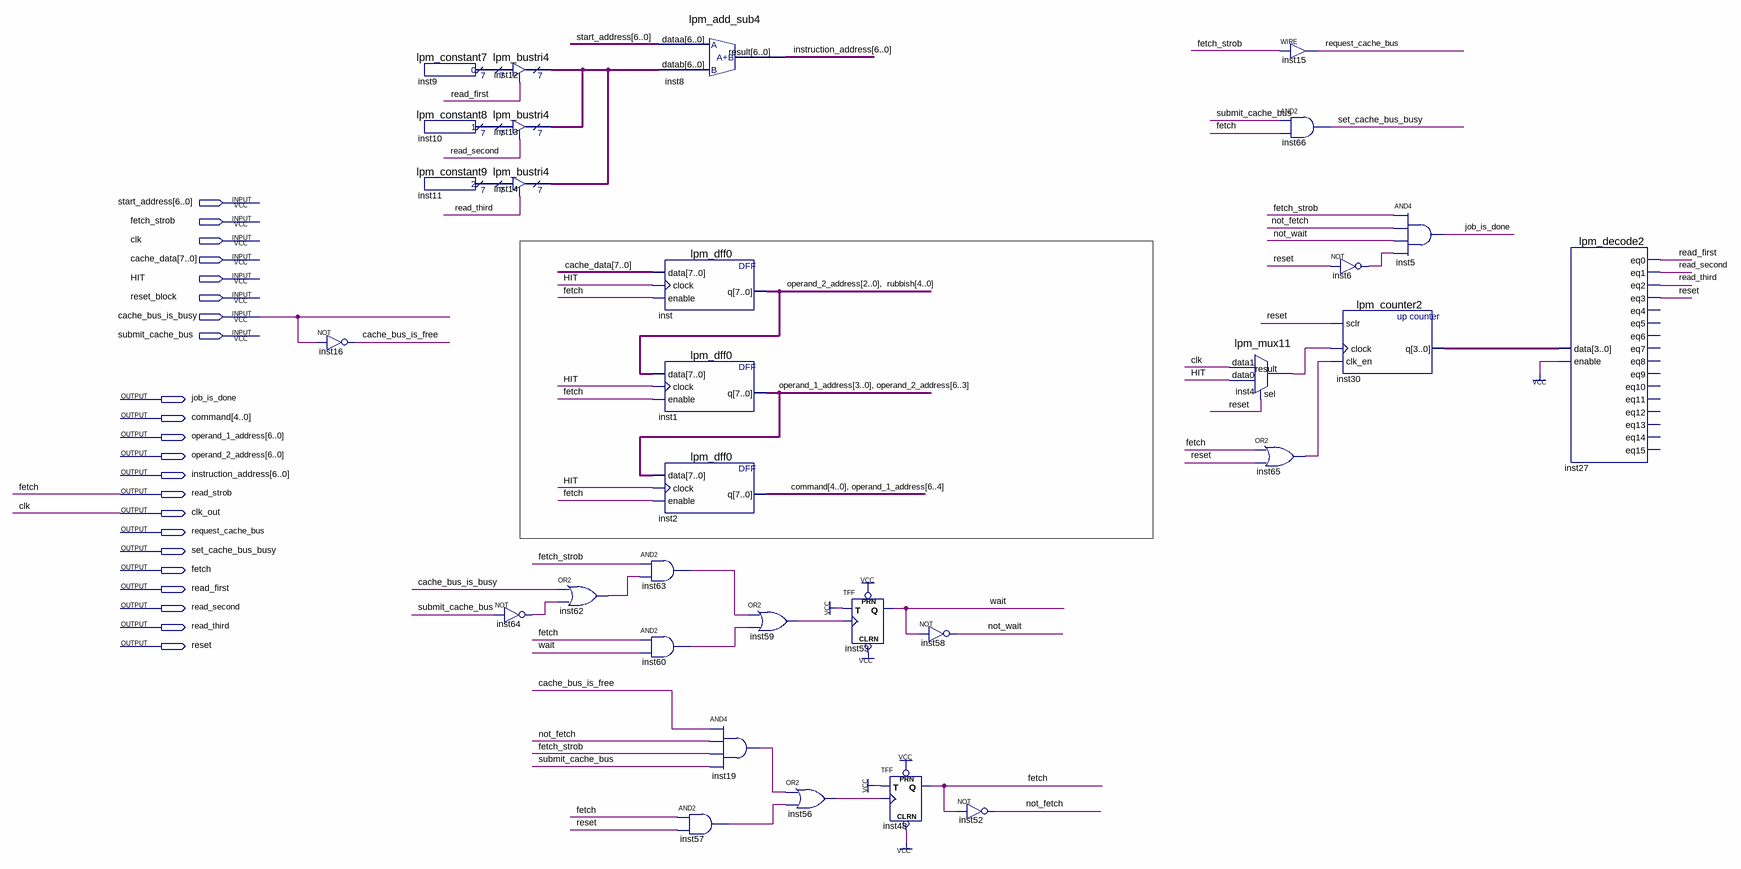
[diagram p0: schematic sheet]
// Quartus schematic InstructionFetchAndDecodeBlock.bdf as structural Verilog: 31 symbols, 22 pins
module InstructionFetchAndDecodeBlock (
  input  [6:0] start_address,
  input  fetch_strob,
  input  clk,
  input  [7:0] cache_data,
  input  HIT,
  input  reset_block,
  input  cache_bus_is_busy,
  input  submit_cache_bus,
  output job_is_done,
  output [4:0] command,
  output [6:0] operand_1_address,
  output [6:0] operand_2_address,
  output [6:0] instruction_address,
  output read_strob,
  output clk_out,
  output request_cache_bus,
  output set_cache_bus_busy,
  output fetch,
  output read_first,
  output read_second,
  output read_third,
  output reset
);

  wire cache_bus_is_free, inst4_result, inst6_out, inst19_out, inst56_out, inst57_out, inst59_out,
       inst60_out, inst62_out, inst63_out, inst64_out, inst65_out, not_fetch, not_wait, \wait ;
  wire [3:0] inst30_q;
  wire [4:0] rubbish;
  wire [6:0] inst9_result, inst10_result, inst11_result, inst12_tridata;

  not inst16 (cache_bus_is_free, cache_bus_is_busy);
  lpm_constant7 inst9 (.result(inst9_result));
  lpm_constant8 inst10 (.result(inst10_result));
  lpm_constant9 inst11 (.result(inst11_result));
  lpm_bustri4 inst12 (.enabledt(read_first), .data(inst9_result), .tridata(inst12_tridata));
  lpm_bustri4 inst13 (.enabledt(read_second), .data(inst10_result), .tridata(inst12_tridata));
  lpm_bustri4 inst14 (.enabledt(read_third), .data(inst11_result), .tridata(inst12_tridata));
  not inst64 (inst64_out, submit_cache_bus);
  or inst62 (inst62_out, cache_bus_is_busy, inst64_out);
  and inst63 (inst63_out, fetch_strob, inst62_out);
  and inst60 (inst60_out, fetch, \wait );
  lpm_add_sub4 inst8 (.dataa(start_address), .datab(inst12_tridata), .result(instruction_address));
  lpm_dff0 inst (.data(cache_data), .clock(HIT), .enable(fetch), .q({operand_2_address[2:0], rubbish}));
  lpm_dff0 inst1 (
    .data({operand_2_address[2:0], rubbish}), .clock(HIT), .enable(fetch),
    .q({operand_1_address[3:0], operand_2_address[6:3]}));
  lpm_dff0 inst2 (
    .data({operand_1_address[3:0], operand_2_address[6:3]}), .clock(HIT), .enable(fetch),
    .q({command, operand_1_address[6:4]}));
  and inst57 (inst57_out, fetch, reset);
  or inst59 (inst59_out, inst63_out, inst60_out);
  and inst19 (inst19_out, cache_bus_is_free, not_fetch, fetch_strob, submit_cache_bus);
  or inst56 (inst56_out, inst19_out, inst57_out);
  TFF inst53 (.PRN(1'b1), .CLRN(1'b1), .T(1'b1), .CLK(inst59_out), .Q(\wait ));
  TFF inst48 (.PRN(1'b1), .CLRN(1'b1), .T(1'b1), .CLK(inst56_out), .Q(fetch));
  not inst58 (not_wait, \wait );
  not inst52 (not_fetch, fetch);
  lpm_mux11 inst4 (.data1(clk), .data0(HIT), .sel(reset), .result(inst4_result));
  or inst65 (inst65_out, fetch, reset);
  assign request_cache_bus = fetch_strob;  // WIRE inst15
  and inst66 (set_cache_bus_busy, submit_cache_bus, fetch);
  not inst6 (inst6_out, reset);
  lpm_counter2 inst30 (.sclr(reset), .clock(inst4_result), .clk_en(inst65_out), .q(inst30_q));
  and inst5 (job_is_done, fetch_strob, not_fetch, not_wait, inst6_out);
  lpm_decode2 inst27 (
    .data(inst30_q), .enable(1'b1), .eq0(read_first), .eq1(read_second), .eq2(read_third), .eq3(reset));  // open: eq4, eq5, eq6, eq7, eq8, eq9, eq10, eq11, eq12, eq13, eq14, eq15

  assign clk_out = clk;
  assign read_strob = fetch;
endmodule
